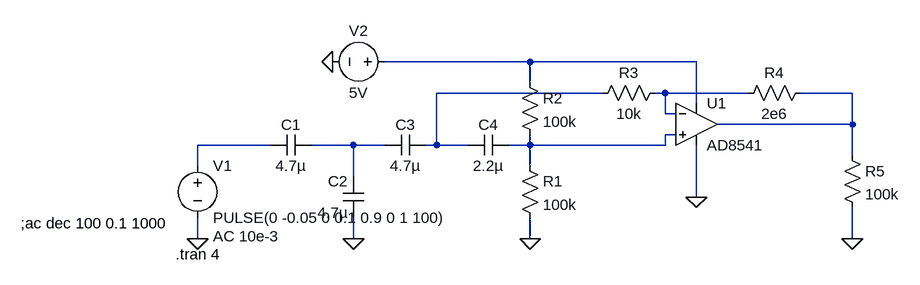
[diagram p0: schematic Draft1.asc]
Draft1.asc, the LTspice schematic file:
Version 4
SHEET 1 1104 680
WIRE 528 -48 304 -48
WIRE 784 -48 528 -48
WIRE 528 -16 528 -48
WIRE 640 0 384 0
WIRE 736 0 720 0
WIRE 864 0 736 0
WIRE 1024 0 944 0
WIRE 784 16 784 -48
WIRE 736 32 736 0
WIRE 752 32 736 32
WIRE 1024 48 1024 0
WIRE 1024 48 816 48
WIRE 752 64 736 64
WIRE 128 80 16 80
WIRE 256 80 192 80
WIRE 304 80 256 80
WIRE 384 80 384 0
WIRE 384 80 368 80
WIRE 432 80 384 80
WIRE 528 80 528 64
WIRE 528 80 496 80
WIRE 736 80 736 64
WIRE 736 80 528 80
WIRE 1024 96 1024 48
WIRE 16 112 16 80
WIRE 528 112 528 80
WIRE 256 128 256 80
WIRE 784 160 784 80
WIRE 16 224 16 192
WIRE 256 224 256 192
WIRE 528 224 528 192
WIRE 1024 224 1024 176
FLAG 16 224 0
FLAG 256 224 0
FLAG 528 224 0
FLAG 784 160 0
FLAG 1024 224 0
FLAG 224 -48 0
SYMBOL voltage 16 96 R0
WINDOW 123 24 124 Left 2
WINDOW 39 0 0 Left 0
SYMATTR InstName V1
SYMATTR Value PULSE(0 -0.05 0 0.1 0.9 0 1 100)
SYMATTR Value2 AC 10e-3
SYMBOL cap 192 64 R90
WINDOW 0 0 32 VBottom 2
WINDOW 3 32 32 VTop 2
SYMATTR InstName C1
SYMATTR Value 4.7µ
SYMBOL cap 272 192 R180
WINDOW 0 24 56 Left 2
WINDOW 3 24 8 Left 2
SYMATTR InstName C2
SYMATTR Value 4.7µ
SYMBOL cap 304 96 R270
WINDOW 0 32 32 VTop 2
WINDOW 3 0 32 VBottom 2
SYMATTR InstName C3
SYMATTR Value 4.7µ
SYMBOL cap 432 96 R270
WINDOW 0 32 32 VTop 2
WINDOW 3 0 32 VBottom 2
SYMATTR InstName C4
SYMATTR Value 2.2µ
SYMBOL res 512 96 R0
SYMATTR InstName R1
SYMATTR Value 100k
SYMBOL res 512 -32 R0
SYMATTR InstName R2
SYMATTR Value 100k
SYMBOL OpAmps\\AD8541 784 -16 R0
SYMATTR InstName U1
SYMBOL res 736 -16 R90
WINDOW 0 0 56 VBottom 2
WINDOW 3 32 56 VTop 2
SYMATTR InstName R3
SYMATTR Value 10k
SYMBOL res 960 -16 R90
WINDOW 0 0 56 VBottom 2
WINDOW 3 32 56 VTop 2
SYMATTR InstName R4
SYMATTR Value 2e6
SYMBOL res 1008 80 R0
SYMATTR InstName R5
SYMATTR Value 100k
SYMBOL voltage 320 -48 R90
WINDOW 0 -32 56 VBottom 2
WINDOW 3 32 56 VTop 2
SYMATTR InstName V2
SYMATTR Value 5V
TEXT -18 248 Left 2 !.tran 4
TEXT -256 200 Left 2 !;ac dec 100 0.1 1000

The netlist it stands for:
* Draft1.asc
V1 N006 0 PULSE(0 -0.05 0 0.1 0.9 0 1 100) AC 10e-3
C1 N007 N006 4.7µ
C2 0 N007 4.7µ
C3 N007 N002 4.7µ
C4 N002 N005 2.2µ
R1 N005 0 100k
R2 N001 N005 100k
XU1 N005 N003 N001 0 N004 AD8541  ; pins In+ In- V+ V- OUT
R3 N003 N002 10k
R4 N004 N003 2e6
R5 N004 0 100k
V2 N001 0 5V
.tran 4
;ac dec 100 0.1 1000
.backanno
.end